# EasyEDA Pro project ProProject_FPC_HDC302x_LPS22_2024-05-12.epro

# Schematic Schematic1
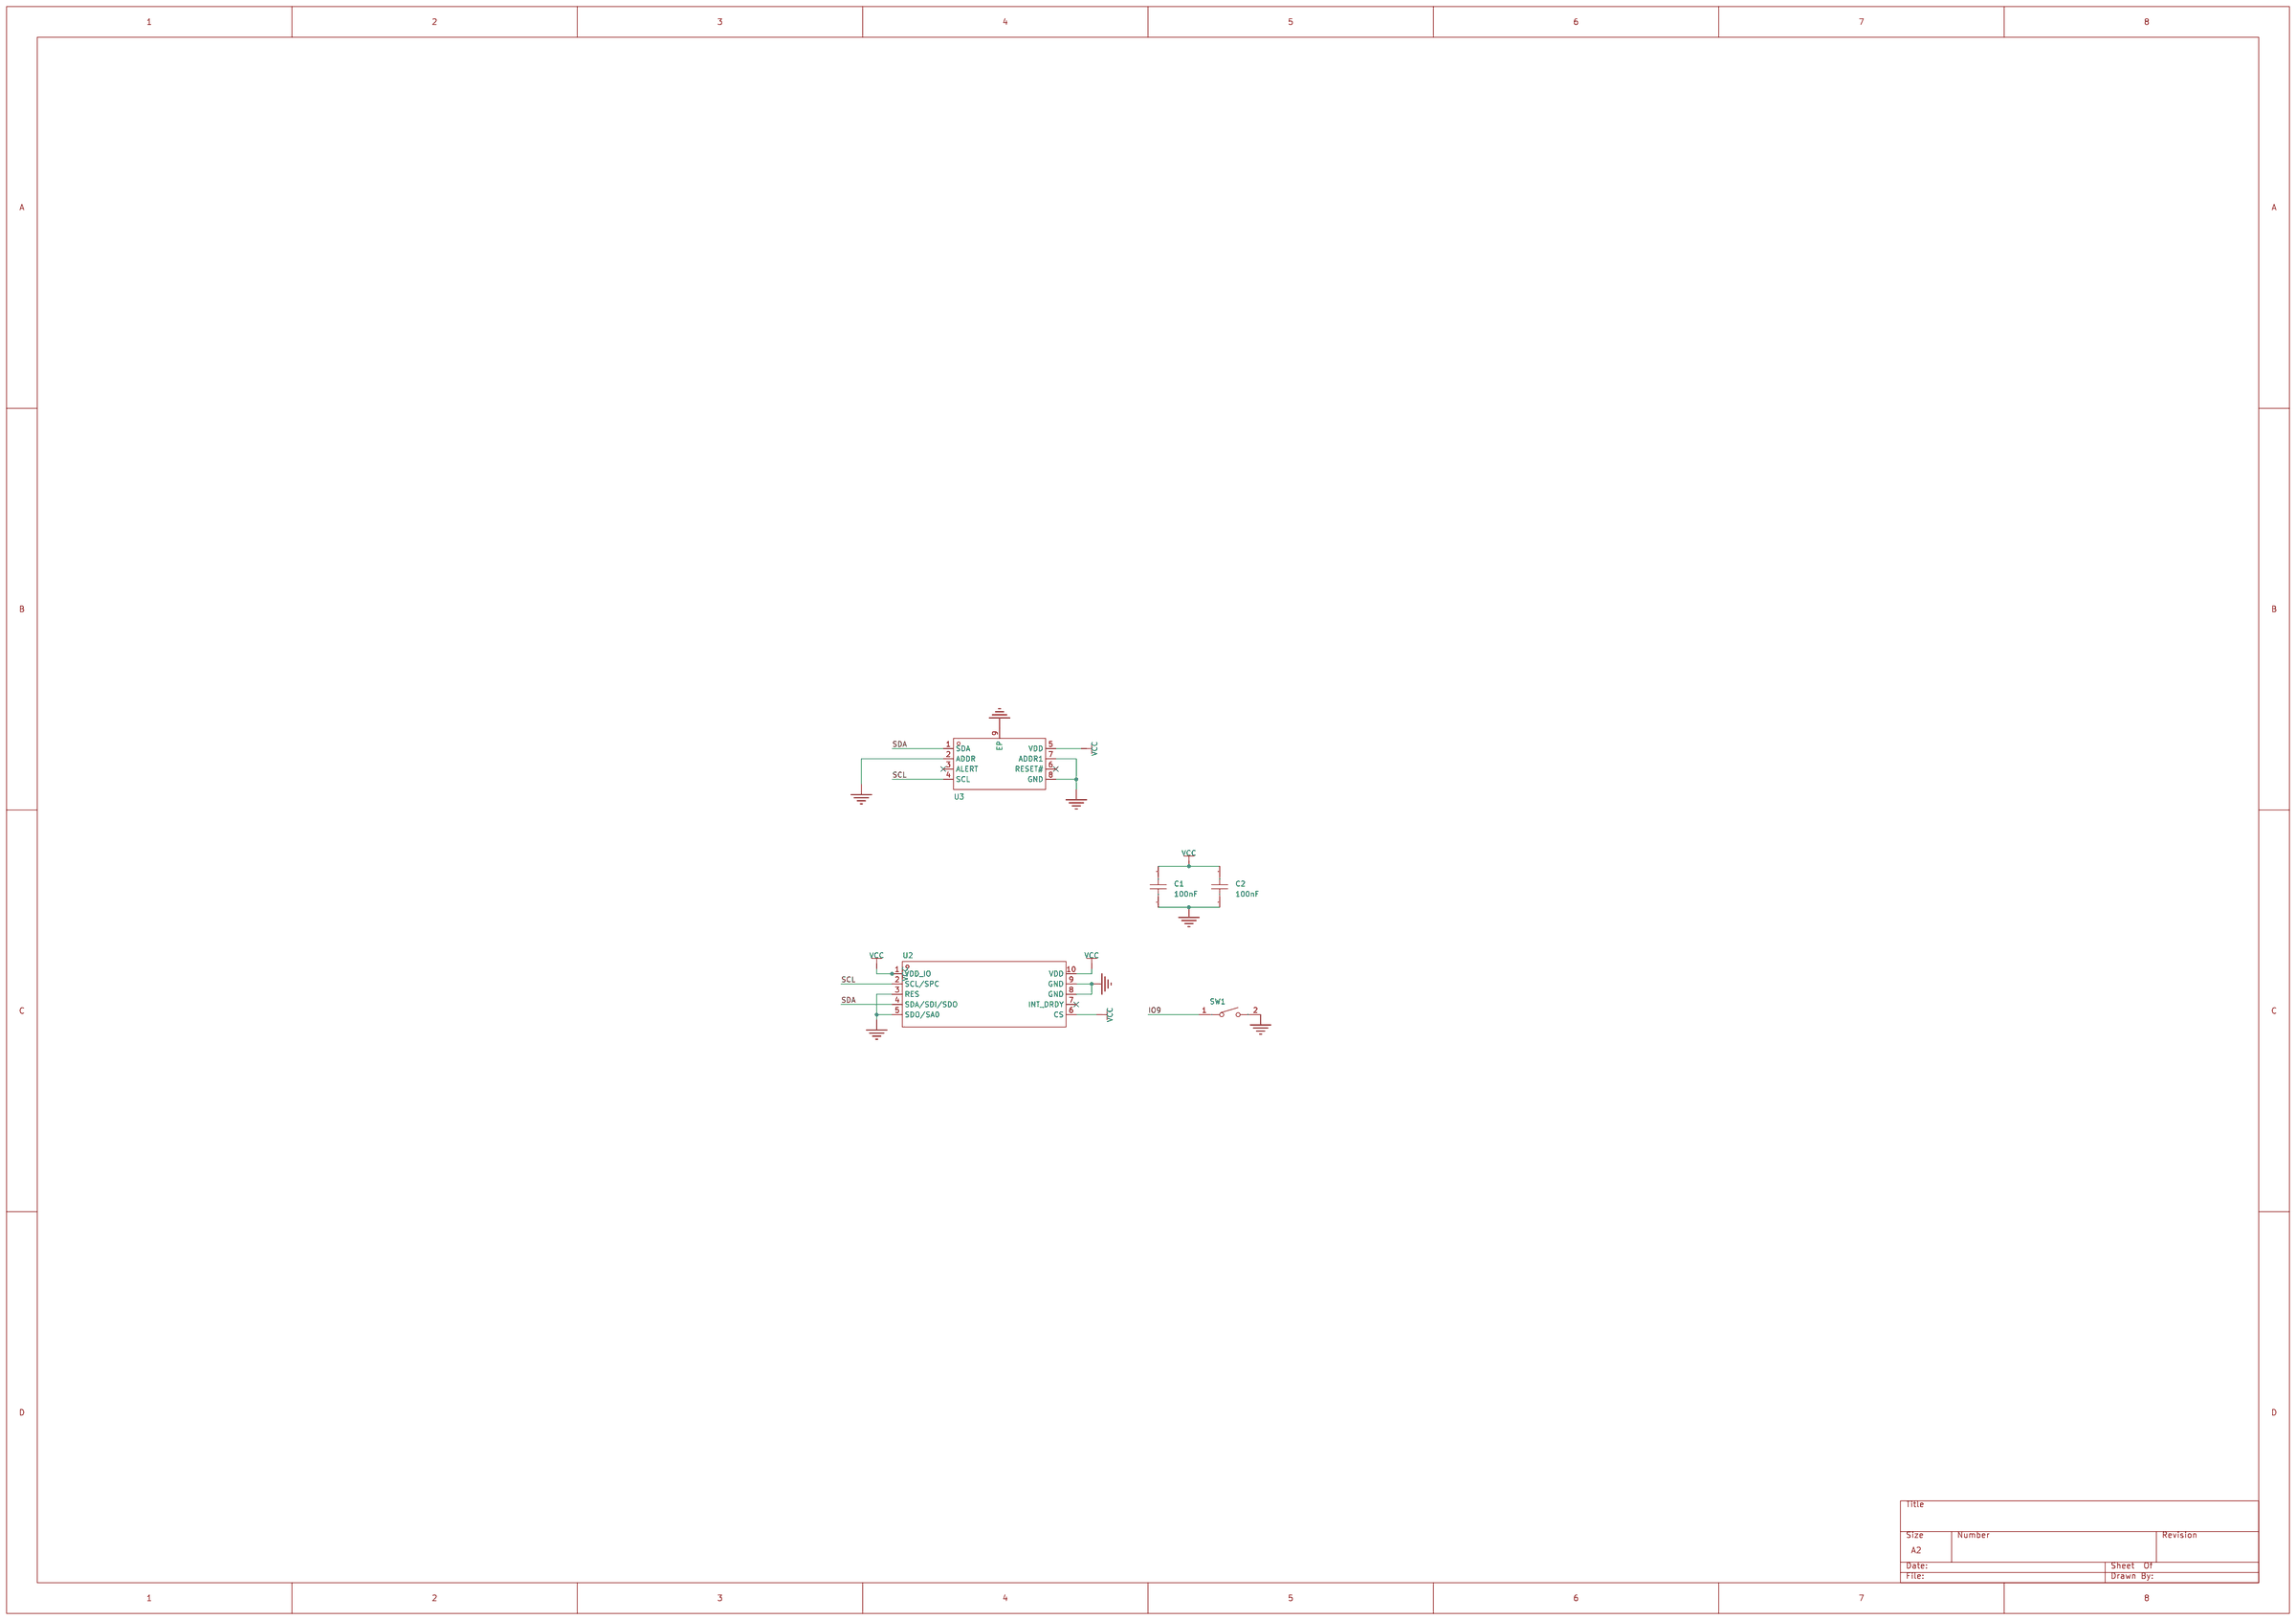
[diagram p0: schematic sheet]

## Parts
C1  100nF  [C0402]
C2  100nF  [C0402]
SW1  TS-1088-AR02016  [SW-SMD_L3.9-W3.0-P4.45]
U2  LPS22HBTR  [HLGA-10L_LPS22HBTR]
U3  HDC3022DEJR  [TDFN-8_L2.5-W2.5-P0.50-BL-EP]

## Library data of the parts
C1 C2 = CAP_0402: Supplier Footprint: 0402
SW1 = TS-1088-AR02016: 电路结构:单刀单掷;按钮形状:圆形按钮;作用力:160gf;安装方式:立贴;开关长度:4mm;开关宽度:3mm;开关高度:2mm;带支架:不带;触点电流:50mA;额定电压(DC):12V;绝缘电阻:100MΩ;机械寿命:10万次;; LCSC Part Name: 4*3*2mm 立贴 轻触开关; Supplier Part: C720477; Manufacturer: XUNPU(讯普); Supplier Footprint: SMD; JLCPCB Part Class: 扩展库; Datasheet: https://atta.szlcsc.com/upload/public/pdf/source/20200810/C720475_60D09DD6C54279ADDB2DC25100F1CC11.pdf; Supplier: LCSC; Circuit: 单刀单掷; Actuator Style: 圆形按钮; Operating Force: 160gf; Mounting Style: 立贴; Switch Length: 4mm; Switch Width: 3mm; Switch Height: 2mm; Strike Gundam: 不带; Contact Current: 50mA; Voltage Rating (DC): 12V; Insulation Resistance: 100MΩ; Actuator/Cap Color: 黑色; Pin Style: SMD接片; Mechanical Life: 10万次; Operating Temperature: -30℃~+80℃
U2 = LPS22HBTR: 压力范围:26Kpa~126Kpa;; Supplier Part: C94049; Manufacturer: ST(意法半导体); Supplier Footprint: HLGA-10(2x2); Datasheet: https://atta.szlcsc.com/upload/public/pdf/source/20170908/C94049_1504870171328958154.pdf; Supplier: LCSC; Pressure range: 26Kpa~126Kpa; The Power Supply Voltage: 1.7V~3.6V; Operating Temperature: -40℃~+85℃
U3 = HDC3022DEJR: 湿度：0%RH~100%RH; Supplier Part: C17434731; Manufacturer: TI(德州仪器); Supplier Footprint: WSON-8(2.5x2.5); Datasheet: https://atta.szlcsc.com/upload/public/pdf/source/20230922/E2A851A59393DDB09DDB78DA9755E936.pdf; Supplier: LCSC; Supply Voltage: 1.62V~5.5V

## Nets
GND: C1.1 C2.1 SW1.2 U2.3(RES) U2.5(SDO/SA0) U2.8(GND) U2.9(GND) U3.2(ADDR) U3.7(ADDR1) U3.8(GND) U3.9(EP)
VCC: C1.2 C2.2 U2.1(VDD_IO) U2.6(CS) U2.10(VDD) U3.5(VDD)
IO9: SW1.1
SCL: U2.2(SCL/SPC) U3.4(SCL)
SDA: U2.4(SDA/SDI/SDO) U3.1(SDA)

Not connected (* = marked no-connect by the designer): U2 7(INT_DRDY)*; U3 3(ALERT)* 6(RESET#)*

# Board PCB1
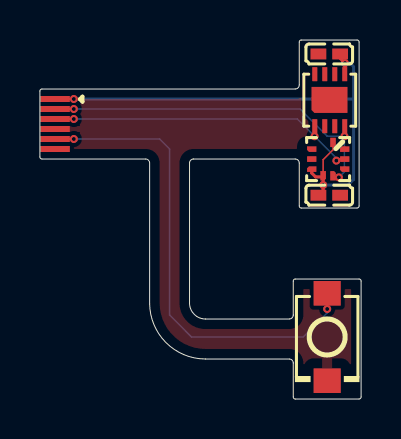
[diagram p1: board, top side]
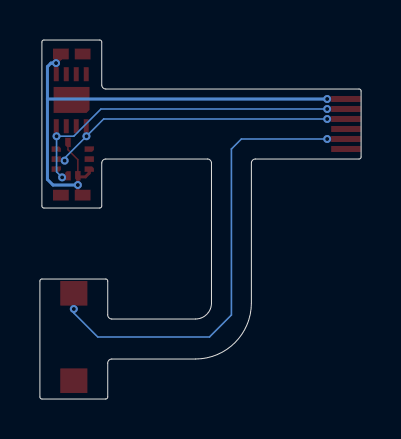
[diagram p2: board, bottom side, seen from below]

Outline 16.1 x 17.95 mm; copper layers: Top Layer, Bottom Layer. Coordinates in mm from the lower left corner of the outline.
Outline path: 0,15.4 0,12.1 arc(0.03,12.03) 0.1,12 5.3,12 arc(5.44,11.94) 5.5,11.8 5.5,4.8 arc(6.32,2.82) 8.3,2 12.5,2 arc(12.64,1.94) 12.7,1.8 12.7,0.1 arc(12.73,0.03) 12.8,0 16,0 arc(16.07,0.03) 16.1,0.1 16.1,5.9 arc(16.07,5.97) 16,6 12.8,6 arc(12.73,5.97) 12.7,5.9 12.7,4.2 arc(12.64,4.06) 12.5,4 8.3,4 arc(7.73,4.23) 7.5,4.8 7.5,11.8 arc(7.56,11.94) 7.7,12 12.8,12 arc(12.94,11.94) 13,11.8 13,9.65 arc(13.03,9.58) 13.1,9.55 15.9,9.55 arc(15.97,9.58) 16,9.65 16,17.85 arc(15.97,17.92) 15.9,17.95 13.1,17.95 arc(13.03,17.92) 13,17.85 13,15.7 arc(12.94,15.56) 12.8,15.5 0.1,15.5 arc(0.03,15.47) 0,15.4
Stack: Top Layer 0.012mm / Dielectric1 0.025mm FR4 er 4.5 / Bottom Layer 0.012mm

## Design rules (mm)
template: 自定义配置
spacing copperThickness1oz (default): track to track 0.076, other pairs 0.076 to 0.152
spacing copperThickness2oz: track to track 0.203, other pairs 0.152 to 0.3
track width copperThickness1oz (default): min 0.076, default 0.076, max 2.54
track width copperThickness2oz: min 0.203, default 0.254, max 2.54
differential pair differentialPair (default): width min 0.127, default 0.254, max 2.54; gap min 0.152, default 0.152
via viaSize (default): diameter min 0.399, default 0.399, max 10; hole min 0.201, default 0.201, max 6.299

## Placement (name value [footprint] x y rotation side)
C1  100nF  [C0402]  14.5 17.25 0 top
C2  100nF  [C0402]  14.5 10.19 180 top
NOREF  -  [Pad_e17]  0.75 12.5 90 top
NOREF#2  -  [Pad_e6]  0.75 13 90 top
NOREF#3  -  [Pad_e12]  0.75 14 90 top
NOREF#4  -  [Pad_e13]  0.75 13.5 90 top
NOREF#5  -  [Pad_e11]  0.75 14.5 90 top
NOREF#6  -  [Pad_e8]  0.75 15 90 top
SW1  TS-1088-AR02016  [SW-SMD_L3.9-W3.0-P4.45]  14.4 3.1 270 top
U2  LPS22HBTR  [HLGA-10L_LPS22HBTR]  14.45 12 90 top
U3  HDC3022DEJR  [TDFN-8_L2.5-W2.5-P0.50-BL-EP]  14.53 14.94 0 top

## Footprints (pads in the part's own frame, mm; a bottom-side part is the same pattern mirrored in y, then rotated)
C0402
  rect 0.79x0.54 smd: 1(-0.545,0) 2(0.545,0)
HLGA-10L_LPS22HBTR
  custom 0.465x0.28 smd: 1(-0.832,0.255) 2(-0.835,-0.241) 6(0.835,-0.241)
  custom 0.28x0.465 smd: 3(-0.5,-0.827) 5(0.5,-0.827) 8(0.5,0.827) 10(-0.5,0.827)
  rect 0.28x0.465 smd: 4(0,-0.828) 9(0,0.828)
Pad_e6
  rect 0.3x1.5 smd: 11(0,0)
Pad_e8
  rect 0.3x1.5 smd: 11(0,0)
Pad_e11
  rect 0.3x1.5 smd: 11(0,0)
Pad_e12
  rect 0.3x1.5 smd: 11(0,0)
Pad_e13
  rect 0.3x1.5 smd: 11(0,0)
Pad_e17
  rect 0.3x1.5 smd: 11(0,0)
SW-SMD_L3.9-W3.0-P4.45
  rect 1.23x1.36 smd: 1(-2.185,0) 2(2.185,0)
TDFN-8_L2.5-W2.5-P0.50-BL-EP
  rect 0.25x0.7 smd: 1(-0.75,-1.3) 2(-0.25,-1.3) 3(0.25,-1.3) 4(0.75,-1.3) 5(0.75,1.3) 6(0.25,1.3) 7(-0.25,1.3) 8(-0.75,1.3)
  custom 1.8x1.3 smd: 9(-0.015,0.013)

## Nets
GND: C1.1 C2.1 NOREF#4.11 SW1.2 U2.3 U2.5 U2.8 U2.9 U3.2 U3.7 U3.8 U3.9
VCC: C1.2 C2.2 NOREF#6.11 U2.1 U2.6 U2.10 U3.5
IO9: NOREF#2.11 SW1.1
SCL: NOREF#5.11 U2.2 U3.4
SDA: NOREF#3.11 U2.4 U3.1

Pads without a net: NOREF 11; U3 3 6

## Via types
v1: diameter 0.399, hole 0.201, Top Layer to Bottom Layer, 11 vias

## Routing (per net, layer and track width the routed paths; a pad name or vN(x,y) marks a point on that pad's centre or on a via; arc(x,y) is an arc through that point)
VCC: length 27.7
  Top Layer w0.076: NOREF#6.11 v1(1.7,15) ; U2.1 14.2,11.97 14.69,12.47 14.69,12.83
  Top Layer w0.15: 14.2,11.16 v1(14.2,10.7) 14.2,10.43 C2.2 ; U2.10 13.63,11.3 13.82,11.11 14.14,11.11 U2.1 ; C1.2 15.05,17.04 v1(15.29,16.8) 15.29,16.25 U3.5
  Bottom Layer w0.15: v1(1.7,15) 15.72,15 ; 15.72,15 15.72,10.98 15.44,10.7 v1(14.2,10.7) ; 15.72,15 15.72,16.62 15.54,16.8 v1(15.29,16.8)
IO9: length 24.1
  Top Layer w0.076: SW1.1 v1(14.4,4.5) ; v1(1.7,13) NOREF#2.11
  Bottom Layer w0.076: v1(14.4,4.5) 14.4,4.3 13.2,3.1 7.6,3.1 6.5,4.2 6.5,12.5 6,13 v1(1.7,13)
SCL: length 18.1
  Top Layer w0.076: v1(15.27,13.14) 15.28,13.15 U3.4 ; v1(14.99,11.08) 14.77,11.08 U2.2 ; NOREF#5.11 v1(1.7,14.5)
  Bottom Layer w0.076: v1(14.99,11.08) 15.27,11.36 v1(15.27,13.14) 14.4,13.14 13.04,14.5 v1(1.7,14.5)
SDA: length 16
  Top Layer w0.076: v1(13.77,13.14) 13.77,13.63 13.78,13.64 ; NOREF#3.11 v1(1.7,14) ; v1(14.86,11.92) 14.94,12 U2.4
  Bottom Layer w0.076: v1(14.86,11.92) 14.86,12.05 v1(13.77,13.14) 12.9,14 v1(1.7,14)

## Copper pours and planes (outline as drawn; the poured copper is in the pictures)
GND on Top Layer: -1.6,20.89 20.88,20.89 20.88,-2.62 -1.6,-2.62
